# Altium schematic sheet UHF RFID READER IC.SchDoc
size A4; SheetNumber: 2; SheetTotal: 10
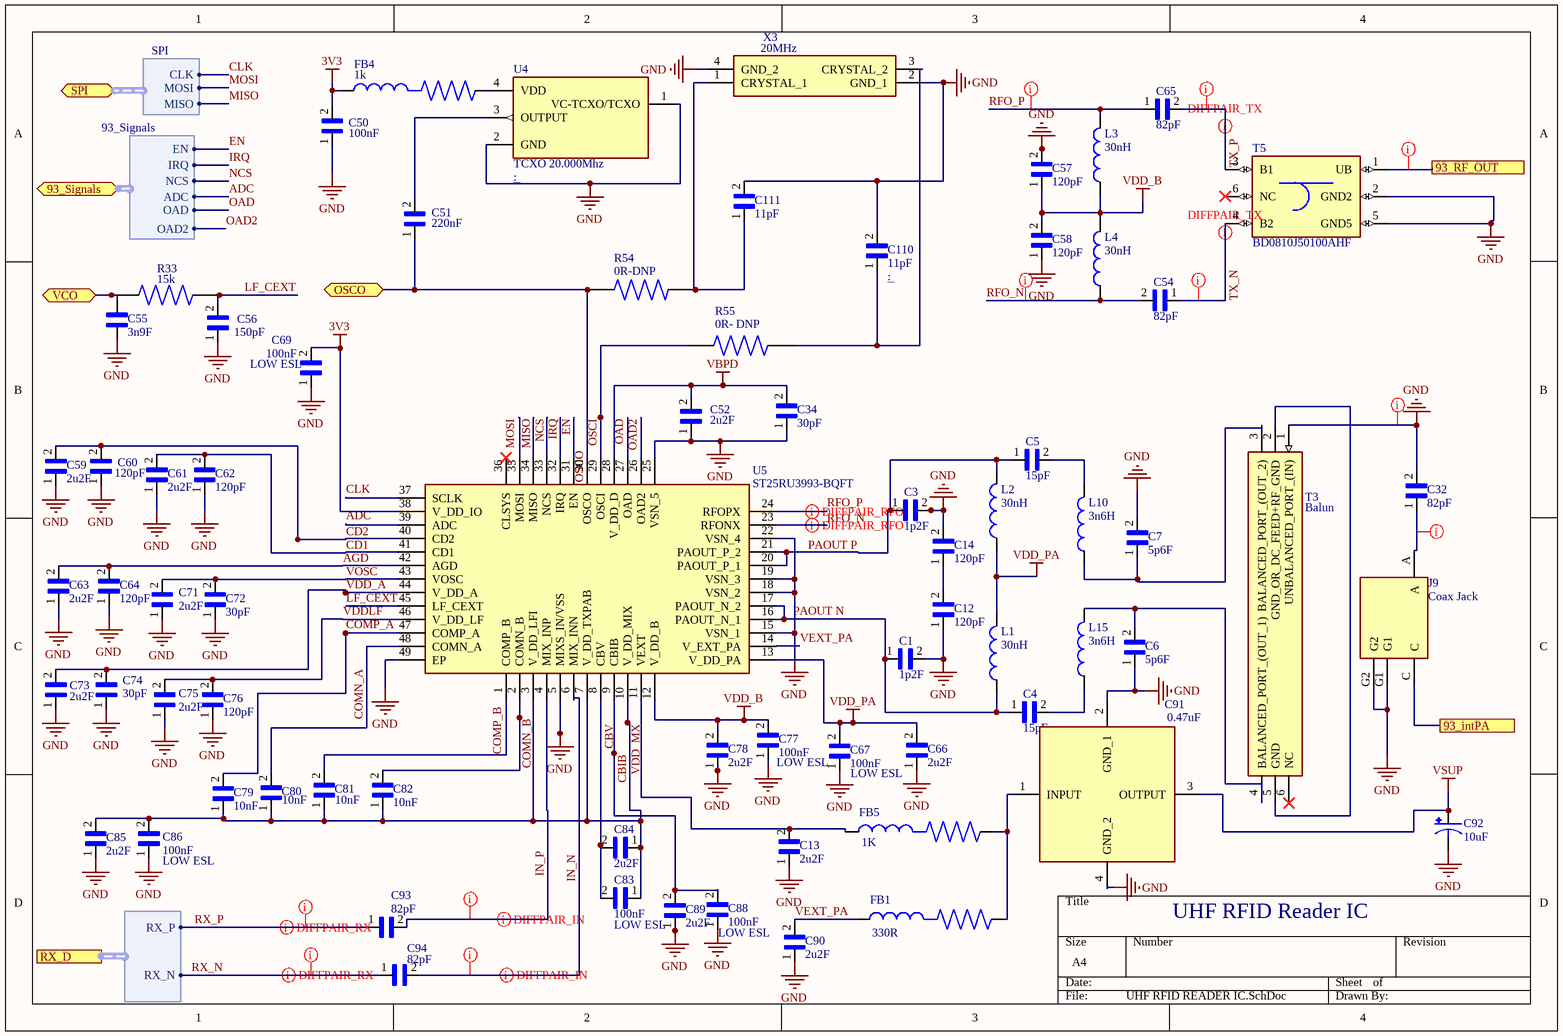
[diagram p0: UHF RFID READER IC.SchDoc]

## Parts
C1  1p2F  [CAPC1005X55N]
C3  1p2F  [CAPC1005X55N]
C4  15pF  [CAPC1005X55N]
C5  15pF  [CAPC1005X55N]
C6  5p6F  [CAPC1005X55N]
C7  5p6F  [CAPC1005X55N]
C12  120pF  [CAPC0603X33N]
C13  2u2F  [CAPC0603X35N]
C14  120pF  [CAPC0603X33N]
C32  82pF  [CAPC1005X55N]
C34  30pF  [CAPC0603X33N]
C50  100nF  [CAPC1005X55N]
C51  220nF  [CAPC1005X55N]
C52  2u2F  [CAPC0603X35N]
C54  82pF  [CAPC1005X55N]
C55  3n9F  [CAPC1005X55N]
C56  150pF  [CAPC1005X55N]
C57  120pF  [CAPC0603X33N]
C58  120pF  [CAPC0603X33N]
C59  2u2F  [CAPC0603X35N]
C60  120pF  [CAPC0603X33N]
C61  2u2F  [CAPC0603X35N]
C62  120pF  [CAPC0603X33N]
C63  2u2F  [CAPC0603X35N]
C64  120pF  [CAPC0603X33N]
C65  82pF  [CAPC1005X55N]
C66  2u2F  [CAPC0603X35N]
C67  100nF  [CAPC0510X35N]
C69  100nF  [CAPC0510X35N]
C71  2u2F  [CAPC0603X35N]
C72  30pF  [CAPC0603X33N]
C73  2u2F  [CAPC0603X35N]
C74  30pF  [CAPC0603X33N]
C75  2u2F  [CAPC0603X35N]
C76  120pF  [CAPC0603X33N]
C77  100nF  [CAPC0510X35N]
C78  2u2F  [CAPC0603X35N]
C79  10nF  [CAPC0603X33N]
C80  10nF  [CAPC0603X33N]
C81  10nF  [CAPC0603X33N]
C82  10nF  [CAPC0603X33N]
C83  100nF  [CAPC0510X35N]
C84  2u2F  [CAPC0603X35N]
C85  2u2F  [CAPC0603X35N]
C86  100nF  [CAPC0510X35N]
C88  100nF  [CAPC0510X35N]
C89  2u2F  [CAPC0603X35N]
C90  2u2F  [CAPC0603X35N]
C91  0.47uF  [NFM18CC101R1C3D]
C92  10uF  [2917(POL)]
C93  82pF  [CAPC1005X55N]
C94  82pF  [CAPC1005X55N]
C110  11pF  [CAPC1005X55N]
C111  11pF  [CAPC1005X55N]
FB1  330R  [BEADC1005X55N]
FB4  1k  [BEADC1005X55N]
FB5  1K  [BEADC1005X55N]
J9  Coax Jack  [SW_MS-156HF(01)]
L1  30nH  [INDC1005X60N]
L2  30nH  [INDC1005X60N]
L3  30nH  [INDC1005X60N]
L4  30nH  [INDC1005X60N]
L10  3n6H  [INDC1006X60N]
L15  3n6H  [INDC1006X60N]
R33  15k  [RES_ERJ-2GEJ153X]
R54  0R-DNP  [RESC1607X60N]
R55  0R- DNP  [RESC1607X60N]
T3  Balun  [0900BL15C050E]
T5  BD0810J50100AHF  [BD0810J50100AHF]
U4  TCXO 20.000Mhz  [OSCCC320X250X100N]
U5  ST25RU3993-BQFT  [FP-ST25RU3993-BQFT-IPC_A]
X3  20MHz  [NX3225SA20000000MHZB2]

## Ports
93_intPA (see System Overview[2A], External Power Amplifier[3A]), 93_RF_OUT (see System Overview[2A], External Power Amplifier[1B]), 93_Signals (bidir, harness 93_Signals, see System Overview[1A], External interfaces and connections[1B], Microcontroller[4A]), OSCO (bidir, see System Overview[1A], External interfaces and connections[4C]), RX_D (harness RX_D, see System Overview[2A], Carrier Cancellation Circuit[3B]), SPI (bidir, harness SPI, see System Overview[1A], Carrier Cancellation Circuit[1A], External interfaces and connections[1A], Microcontroller[4A]), VCO (bidir, see System Overview[1B], External interfaces and connections[4C])

## Harnesses
SPI: CLK, MISO, MOSI
93_Signals: EN, IRQ, NCS, ADC, OAD, OAD2
RX_D: RX_P, RX_N

## Nets
3V3: C50.2 C69.2 FB4.1 U5.38(V_DD_IO)
GND: C1.2 C3.2 C6.1 C7.2 C12.1 C13.1 C14.2 C32.2 C34.1 C50.1 C52.1 C55.1 C56.1 C57.2 C58.1 C59.1 C60.1 C61.1 C62.1 C63.1 C64.1 C66.1 C67.1 C69.1 C71.1 C72.1 C73.1 C74.1 C75.1 C76.1 C77.1 C78.1 C85.1 C86.1 C88.1 C89.1 C90.1 C91.2(GND_1) C91.4(GND_2) C92.2(NEG) C110.2 C111.2 J9.G1 J9.G2 T3.1(UNBALANCED_PORT_(IN)) T5.2(GND2) T5.5(GND5) U4.1(VC-TCXO/TCXO) U4.2(GND) U5.5(MIXS_IN/VSS) U5.15(VSN_1) U5.18(VSN_2) U5.19(VSN_3) U5.22(VSN_4) U5.25(VSN_5) U5.49(EP) X3.2(GND_1) X3.4(GND_2)
VBPD: C34.2 C52.2 U5.28(V_DD_D)
VDD_B: C57.1 C58.2 C77.2 C78.2 L3.1 L4.2 U5.12(V_DD_B)
VDD_PA: C66.2 C67.2 L1.2 L2.1 U5.13(V_DD_PA)
VSUP: C91.3(OUTPUT) C92.1(POS)
93_intPA: J9.C ; port 93_intPA
93_RF_OUT: T5.1(UB) ; port 93_RF_OUT
ADC: U5.39(ADC) ; port 93_Signals.ADC
AGD: C63.2 C64.2 U5.42(AGD)
CBIB: C88.2 C89.2 U5.9(CBIB)
CBV: C83.2 C84.2 U5.8(CBV)
CD1: C61.2 C62.2 U5.41(CD1)
CD2: C59.2 C60.2 U5.40(CD2)
CLK: U5.37(SCLK) ; port SPI.CLK
COMN_A: C80.2 U5.48(COMN_A)
COMN_B: C82.2 U5.2(COMN_B)
COMP_A: C79.2 U5.47(COMP_A)
COMP_B: C81.2 U5.1(COMP_B)
EN: U5.31(EN) ; port 93_Signals.EN
IN_N: C94.2 U5.6(MIX_INN)
IN_P: C93.2 U5.4(MIX_INP)
IRQ: U5.32(IRQ) ; port 93_Signals.IRQ
LF_CEXT: C56.2 R33.2 U5.45(LF_CEXT)
MISO: U5.34(MISO) ; port SPI.MISO
MOSI: U5.35(MOSI) ; port SPI.MOSI
NCS: U5.33(NCS) ; port 93_Signals.NCS
OAD: U5.27(OAD) ; port 93_Signals.OAD
OAD2: U5.26(OAD2) ; port 93_Signals.OAD2
OSCI: R55.1 U5.29(OSCI)
OSCO: C51.1 R54.1 U5.30(OSCO) ; port OSCO
PAOUT N: C1.1 C4.1 L1.1 U5.16(PAOUT_N_1) U5.17(PAOUT_N_2)
PAOUT P: C3.1 C5.1 L2.2 U5.20(PAOUT_P_1) U5.21(PAOUT_P_2)
RFO_N: C54.2 L4.1 U5.23(RFONX)
RFO_P: C65.1 L3.2 U5.24(RFOPX)
RX_N: C94.1 ; port RX_D.RX_N
RX_P: C93.1 ; port RX_D.RX_P
TX_N: C54.1 T5.4(B2)
TX_P: C65.2 T5.3(B1)
VCO: C55.2 R33.1 ; port VCO
VDD_A: C73.2 C74.2 U5.44(V_DD_A)
VDD_MX: C79.1 C80.1 C81.1 C82.1 C83.1 C84.1 C85.2 C86.2 U5.3(V_DD_LFI) U5.7(V_DD_TXPAB) U5.10(V_DD_MIX)
VDDLF: C75.2 C76.2 U5.46(V_DD_LF)
VEXT_PA: C90.2 FB1.1 U5.14(V_EXT_PA)
VOSC: C71.2 C72.2 U5.43(VOSC)
NetC4_2: C4.2 L15.1
NetC5_2: C5.2 L10.2
NetC6_2: C6.2 L15.2 T3.4(BALANCED_PORT_(OUT_1))
NetC7_1: C7.1 L10.1 T3.3(BALANCED_PORT_(OUT_2))
NetC12_2: C12.2 C14.1
NetC13_2: C13.2 FB5.1 U5.11(VEXT)
NetC32_1: C32.1 J9.A
NetC51_2: C51.2 U4.3(OUTPUT)
NetC91_1: C91.1(INPUT) FB1.2 FB5.2
NetC110_1: C110.1 R55.2 X3.3(CRYSTAL_2)
NetC111_1: C111.1 R54.2 X3.1(CRYSTAL_1)
NetFB4_2: FB4.2 U4.4(VDD)
NetT3_2: T3.2(GND_OR_DC_FEED+RF_GND) T3.5(GND)

Not connected (* = marked no-connect by the designer): T3 6(NC)*; T5 6(NC)*; U5 36(CLSYS)*

## Layout directives
differential pair; differential pair class RFO: RFO_N, RFO_P
differential pair; differential pair class TX: TX_N, TX_P
differential pair; differential pair class RX: RX_N, RX_P
differential pair; differential pair class IN: IN_N, IN_P
net class RF_100: IN_N, IN_P, RFO_N, RFO_P, RX_N, RX_P, TX_N, TX_P
net class RF_50: 93_RF_OUT, GND, NetC32_1

## Notes on the sheet
- (near C69) LOW ESL
- LOW ESL
- (near C67) LOW ESL
- (near C86) LOW ESL
- (near C91) UHF RFID Reader IC
- (near C88) LOW ESL

## Library data of the parts
C1 C3 = GRM1555C1H1R2WA01D: SMD Capacitor C0G_EIA_ with Capacitance: 1.2pF Tol. 0.05pF. Rated Voltage: 50Vdc; MF: Murata Electronics; MP: GRM1555C1H1R2WA01D; Availability: Unavailable; Package: 1005 Taiyo Yuden; Value: *; Price: None; SnapEDA_Link: https://www.snapeda.com/parts/GRM1555C1H1R2WA01D/Murata%20Electronics%20North%20America/view-part/1837628/?ref=snap
C4 C5 = GRM1555C1H150GA01D: 0402 15 pF 50 V Â±2% Tolerance C0G SMT Multilayer Ceramic Capacitor; Package: None; Price: None; Value: *; MP: GRM1555C1H150GA01D; Availability: Unavailable
C6 C7 = GJM1555C1H5R6CB01D: SMD Capacitor C0G(EIA) with Capacitance: 5.6pF Tol. 0.25pF. Rated Voltage: 50Vdc; MF: Murata; Purchase-URL: https://pricing.snapeda.com/search/part/GJM1555C1H5R6CB01D/?ref=eda; SnapEDA_Link: https://www.snapeda.com/parts/GJM1555C1H5R6CB01D/Murata/view-part/4376987/?ref=snap; Value: *; MP: GJM1555C1H5R6CB01D; Check_prices: https://www.snapeda.com/parts/GJM1555C1H5R6CB01D/Murata/view-part/4376987/?ref=eda; Package: 1005 Taiyo Yuden; Availability: Good; Price: None
C12 C14 C57 C58 C60 C62 C64 C76 = GRM0335C1H121JA01D: 0201 120 pF 50 V Â±5% Tolerance C0G SMT Multilayer Ceramic Capacitor; MF: Murata Electronics; Check_prices: https://www.snapeda.com/parts/GRM0335C1H121JA01D/Murata%20Electronics%20North%20America/view-part/1767262/?ref=eda; Value: *; Purchase-URL: https://pricing.snapeda.com/search/part/GRM0335C1H121JA01D/?ref=eda; Package: 0603 Taiyo Yuden; Price: None; MP: GRM0335C1H121JA01D; Availability: In Stock; SnapEDA_Link: https://www.snapeda.com/parts/GRM0335C1H121JA01D/Murata%20Electronics%20North%20America/view-part/1767262/?ref=snap
C13 C52 C59 C61 C63 C66 C71 C73 C75 C78 C84 C85 C89 C90 = GRM033R60J225ME15D: SMD Capacitor X5R(EIA) with Capacitance: 2.2uF Tol. 20%. Rated Voltage: 6.3Vdc; Package: None; Price: None; Value: *; MP: GRM033R60J225ME15D; Availability: Unavailable
C32 C54 C65 C93 C94 = GRM1555C1H820GA01J: CAP CER 82PF 50V C0G/NP0 0402; Package: None; Price: None; Value: *; MP: GRM1555C1H820GA01J; Availability: Unavailable
C34 C72 C74 = GRM0335C1H300GA01D: SMD Capacitor C0G(EIA) with Capacitance: 30pF Tol. 2%. Rated Voltage: 50Vdc; Package: None; Price: None; Value: *; MP: GRM0335C1H300GA01D; Availability: Unavailable
C50 = GRM155R71C104KA88D: SMD Capacitor X7R_EIA_ with Capacitance: 0.10uF Tol. 10%. Rated Voltage: 16Vdc; MF: Murata; Package: 1005 Taiyo Yuden; Value: *; MP: GRM155R71C104KA88D; SnapEDA_Link: https://www.snapeda.com/parts/GRM155R71C104KA88D/Murata%20Electronics%20North%20America/view-part/4750/?ref=snap
C51 = GRM155R6YA224KE01D: CAP CER 0.22UF 35V X5R 0402; Package: None; Price: None; Value: *; MP: GRM155R6YA224KE01D; Availability: Unavailable
C55 = GRM1557U1A392JA01D: 0402 10 V 3900 pF ±5% Tolerance U2J Monolithic Ceramic Chip Capacitor; MF: Murata; SnapEDA_Link: https://www.snapeda.com/parts/GRM1557U1A392JA01D/Murata+Electronics+North+America/view-part/?ref=snap; Package: 1005 Taiyo Yuden; Value: *; MP: GRM1557U1A392JA01D; Check_prices: https://www.snapeda.com/parts/GRM1557U1A392JA01D/Murata+Electronics+North+America/view-part/?ref=eda
C56 = GRM1555C1H151FA01D: Cap Ceramic 150pF 50V C0G 1% SMD 0402 125Â°C Paper T/R; Package: None; Price: None; Value: *; MP: GRM1555C1H151FA01D; Availability: Unavailable
C67 C69 C77 C83 C86 C88 = LLL153C80J104ME01E: SMD Capacitor X6S(EIA) with Capacitance: 0.10uF Tol. 20%. Rated Voltage: 6.3Vdc; MF: Murata; Price: None; Value: *; Purchase-URL: https://pricing.snapeda.com/search/part/LLL153C80J104ME01E/?ref=eda; Package: 0510 Murata; SnapEDA_Link: https://www.snapeda.com/parts/LLL153C80J104ME01E/Murata/view-part/4376162/?ref=snap; Availability: Good; MP: LLL153C80J104ME01E
C79-C82 = GRM033R71A103KA01D: SMD Capacitor X7R(EIA) with Capacitance: 10000pF Tol. 10%. Rated Voltage: 10Vdc; MF: Murata; MP: GRM033R71A103KA01D; Availability: Unavailable; SnapEDA_Link: https://www.snapeda.com/parts/GRM033R71A103KA01D/Murata/view-part/4379446/?ref=snap; Value: *; Check_prices: https://www.snapeda.com/parts/GRM033R71A103KA01D/Murata/view-part/4379446/?ref=eda; Package: 0603 Taiyo Yuden; Price: None
C91 = NFM18PS474R0J3D: Capacitor; Manufacturer_Name: Murata Electronics; Datasheet Link: https://psearch.en.murata.com/capacitor/product/NFM18PS474R0J3%23.html; Height: 0.7mm; Manufacturer_Part_Number: NFM18PS474R0J3D; Mouser Part Number: 81-NFM18PS474R0J3D; Mouser Price/Stock: https://www.mouser.co.uk/ProductDetail/Murata-Electronics/NFM18PS474R0J3D?qs=OWtbBJ4e7yHgIGJxSdBqtA%3D%3D; Arrow Part Number: NFM18PS474R0J3D; Arrow Price/Stock: https://www.arrow.com/en/products/nfm18ps474r0j3d/murata-manufacturing?region=nac
C92 = ECASD41C106M060K00: 10 ÂµF 16 V Aluminum - Polymer Capacitors 2917 (7343 Metric) 60mOhm 1000 Hrs @ 105Â°C; MF: Murata Electronics; SnapEDA_Link: https://www.snapeda.com/parts/ECASD41C106M060K00/Murata+Electronics+North+America/view-part/?ref=snap; Package: 2917 Murata; Value: *; MP: ECASD41C106M060K00; Check_prices: https://www.snapeda.com/parts/ECASD41C106M060K00/Murata+Electronics+North+America/view-part/?ref=eda
C110 C111 = GJM1555C1H110GB01D: SMD Capacitor C0G(EIA) with Capacitance: 11pF Tol. 2%. Rated Voltage: 50Vdc; MF: Murata; MP: GJM1555C1H110GB01D; Package: 1005 Taiyo Yuden; Purchase-URL: https://pricing.snapeda.com/search/part/GJM1555C1H110GB01D/?ref=eda; Digi-Key_Part_Number: 490-6072-1-ND; SnapEDA_Link: https://www.snapeda.com/parts/GJM1555C1H110GB01D/Murata/view-part/4385613/?ref=snap; Value: *
FB1 = BLM15PX331SN1D: 330 Ohms @ 100MHz 1 Power Line Ferrite Bead 0402 (1005 Metric) 1.2A 150mOhm; MF: Murata Electronics; SnapEDA_Link: https://www.snapeda.com/parts/BLM15PX331SN1D/Murata/view-part/2723257/?ref=snap; Availability: Good; MP: BLM15PX331SN1D; Package: 1005 Taiyo Yuden; Price: None; Purchase-URL: https://pricing.snapeda.com/search/part/BLM15PX331SN1D/?ref=eda; Value: *
FB4 FB5 = BLM15HG102SN1D: 1 kOhms @ 100MHz 1 Signal Line Ferrite Bead 0402 _1005 Metric_ 250mA 1.1Ohm; MF: Murata; Value: *; SnapEDA_Link: https://www.snapeda.com/parts/BLM15HG102SN1D/Murata/view-part/270056/?ref=snap; Digi-Key_Part_Number: 490-3999-1-ND; Digi-Key_Purchase_URL: https://www.digikey.com/product-detail/en/murata-electronics/BLM15HG102SN1D/490-3999-1-ND/1016259?utm_source=snapeda&utm_medium=aggregator&utm_campaign=symbol; Package: 1005 Taiyo Yuden; MP: BLM15HG102SN1D
J9 = MS-156HF(01): Coaxial Switch - 4mm Plug Dia Connector Receptacle, Female Socket 50Ohm Surface Mount Solder; MF: Hirose Electric; Package: None; MP: MS-156HF(01); Value: *; SnapEDA_Link: https://www.snapeda.com/parts/MS-156HF(01)/Hirose%20Electric%20Co%20Ltd/view-part/1243878/?ref=snap; Price: None; Availability: Unavailable
L1-L4 = LQW15AN30NG00D: Inductor with Inductance: 30nH Tol. +/-2%, Package: 0402 (1005); MF: Murata; SnapEDA_Link: https://www.snapeda.com/parts/LQW15AN30NG00D/Murata%20Electronics%20North%20America/view-part/1502539/?ref=snap; MP: LQW15AN30NG00D; DigiKey-Purchase-URL: https://snapeda.com/shop?store=DigiKey&id=1502539; Package: 1005 Murata; Value: *; Digi-Key_Part_Number: 490-6802-1-ND
L10 L15 = LQW15AN3N6C10D: FIXED IND 3.6NH 900MA 40 MOHM; Package: None; Price: None; Value: *; MP: LQW15AN3N6C10D; Availability: Unavailable
R33 = ERJ-2GEJ153X: 15 kOhms ±5% 0.1W, 1/10W Chip Resistor 0402 (1005 Metric) Automotive AEC-Q200 Thick Film; MF: Panasonic Electronic; SnapEDA_Link: https://www.snapeda.com/parts/ERJ-2GEJ153X/Panasonic+Electronic+Components/view-part/?ref=snap; Package: 1020-2 Panasonic; Value: *; MP: ERJ-2GEJ153X; Check_prices: https://www.snapeda.com/parts/ERJ-2GEJ153X/Panasonic+Electronic+Components/view-part/?ref=eda
R54 R55 = RC0603JR-070RL: Thick film general purpose; Availability: Unavailable; Package: None; MP: RC0603JR-070RL; Value: *; Price: None
T3 = 0900BL15C050E: Filter; Manufacturer_Name: JOHANSON TECHNOLOGY; Datasheet Link: https://www.johansontechnology.com/datasheets/0900BL15C050/0900BL15C050.pdf; Height: 0.8mm; Manufacturer_Part_Number: 0900BL15C050E; Mouser Part Number: 609-0900BL15C050E; Mouser Price/Stock: https://www.mouser.co.uk/ProductDetail/Johanson-Technology/0900BL15C050E?qs=yCnrNFeXz%252BjgDEe7ZYwcVg%3D%3D; Arrow Part Number: 0900BL15C050E; Arrow Price/Stock: https://www.arrow.com/en/products/0900bl15c050e/johanson-dielectrics?region=europe
T5 = BD0810J50100AHF: Signal Conditioning 800-1000MHz 50/100 Ohm IL=.95dB; MF: ttm technologies; SnapEDA_Link: https://www.snapeda.com/parts/BD0810J50100AHF/LM+Technologies/view-part/?ref=snap; Package: None; Value: *; MP: BD0810J50100AHF; Check_prices: https://www.snapeda.com/parts/BD0810J50100AHF/LM+Technologies/view-part/?ref=eda
U4 = TXETDCSANF-20.000000: 20MHz TCXO Clipped Sine Wave Oscillator 2.8V ~ 3.3V 4-SMD, No Lead; MF: Taitien; Package: SMD-4 Taitien; SnapEDA_Link: https://www.snapeda.com/parts/TXETDCSANF-20.000000/Taitien/view-part/3601305/?ref=snap; MP: TXETDCSANF-20.000000; Availability: Warning; Price: None; Value: *; Purchase-URL: https://pricing.snapeda.com/search/part/TXETDCSANF-20.000000/?ref=eda
U5 = ST25RU3993-BQFT: Integrated Circuit; Manufacturer_Name: STMicroelectronics; Datasheet Link: https://www.st.com/resource/en/datasheet/st25ru3993.pdf; Height: 1mm; Manufacturer_Part_Number: ST25RU3993-BQFT; Mouser Part Number: 511-ST25RU3993-BQFT; Mouser Price/Stock: https://www.mouser.co.uk/ProductDetail/STMicroelectronics/ST25RU3993-BQFT?qs=VBQ3p0kw5tgG4N%252BXfjyUgw%3D%3D; Arrow Part Number: ST25RU3993-BQFT; Arrow Price/Stock: https://www.arrow.com/en/products/st25ru3993-bqft/stmicroelectronics?region=nac
X3 = NX3225SA-20.000000MHZ-B2: Crystal or Oscillator; Manufacturer_Name: NDK; Datasheet Link: https://media.digikey.com/pdf/Data%20Sheets/NDK%20PDFs/NX3225SA-20.000000MHz-B2.pdf; Height: 0.7mm; Manufacturer_Part_Number: NX3225SA-20.000000MHZ-B2; Mouser Part Number: 344-NX3225SA20MHZB2; Mouser Price/Stock: https://www.mouser.co.uk/ProductDetail/NDK/NX3225SA-20.000000MHZ-B2?qs=w%2Fv1CP2dgqr91JjcOyduEA%3D%3D